# EAGLE design CurrentAmplifier_V2 (EAGLE 7.5.0)
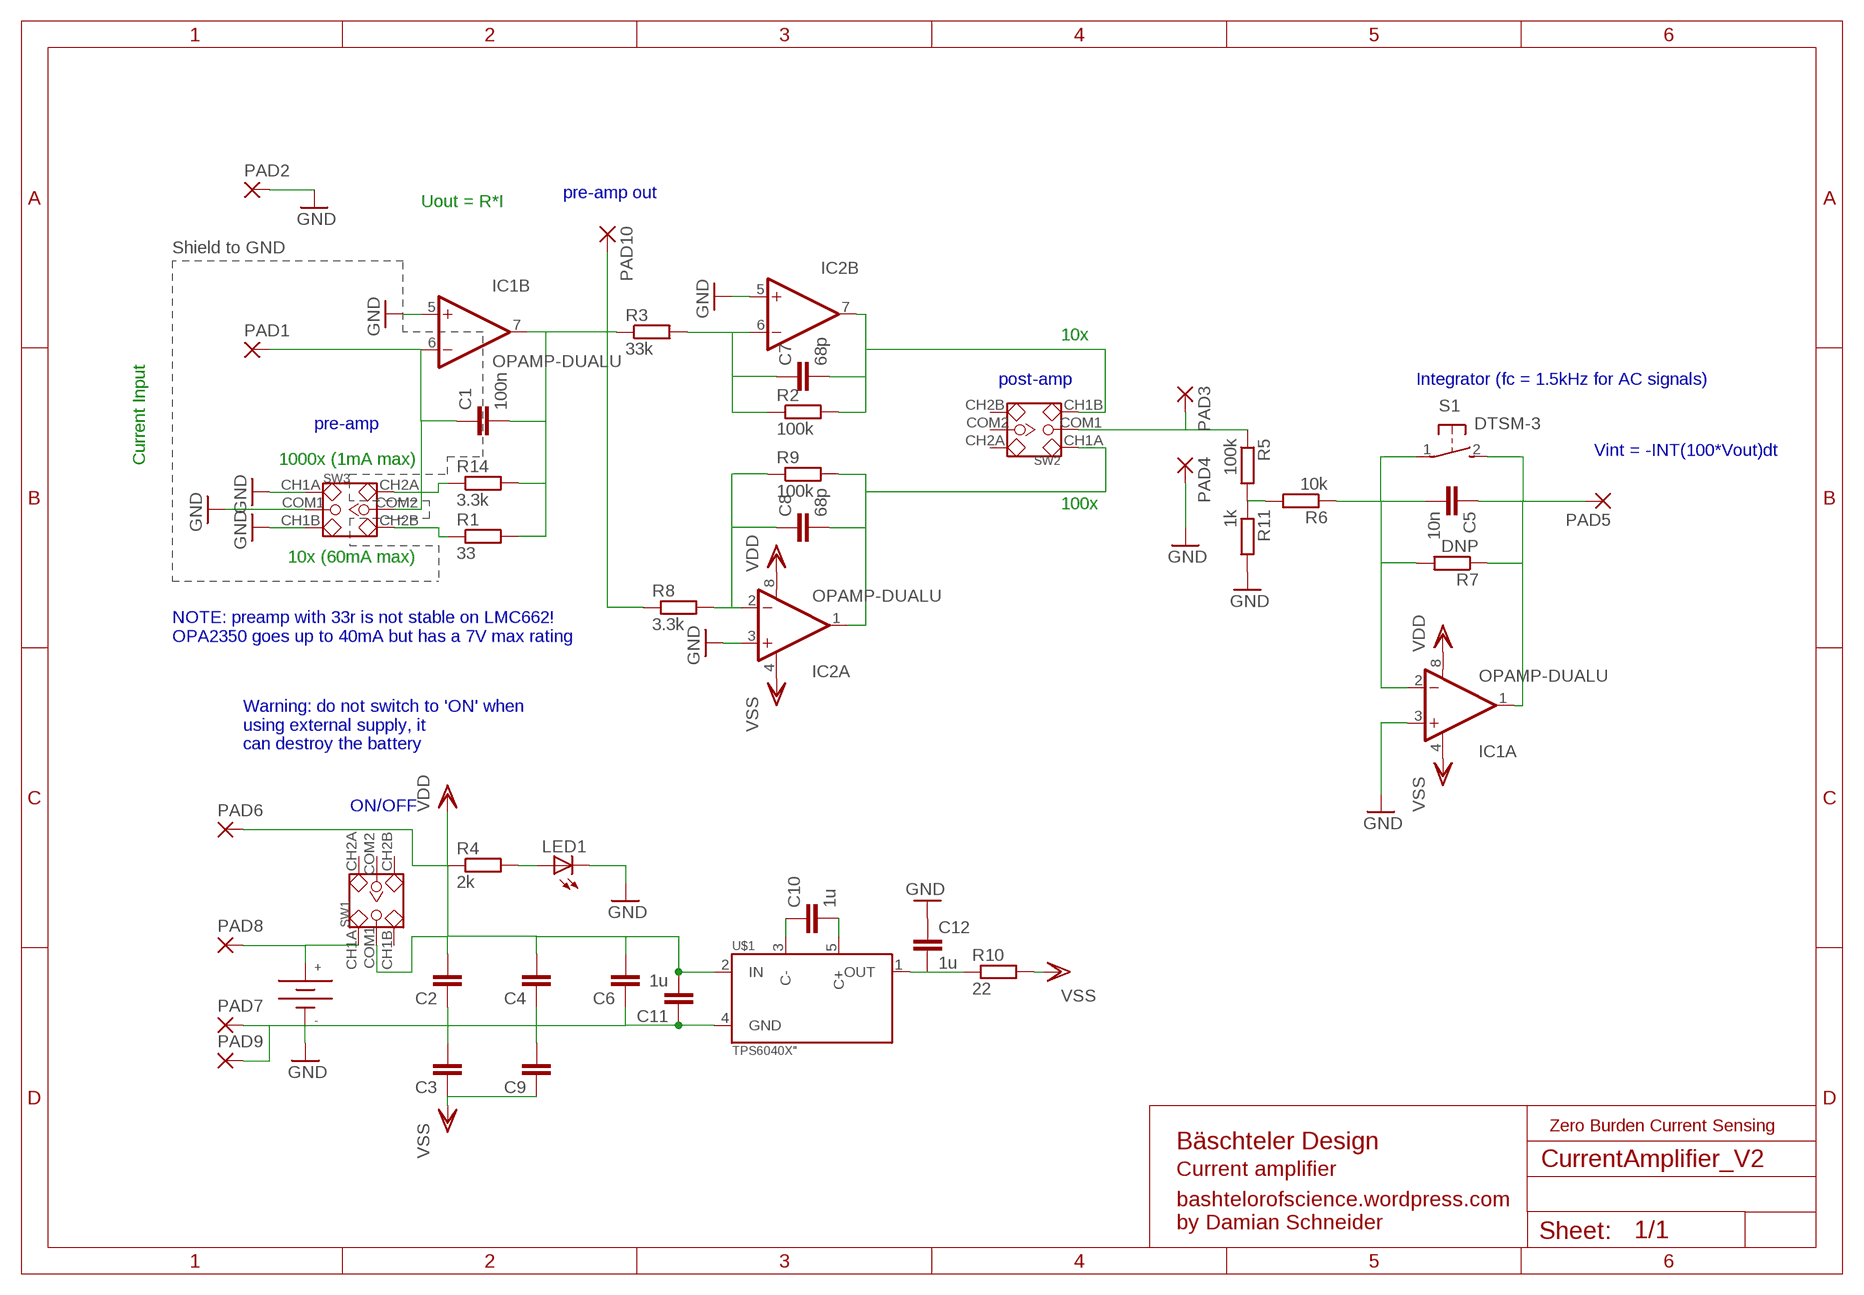
[diagram p0: schematic, sheet 1]

## Parts
C1  100n  C-EUC0805K  [C0805K]
C2  C-EUC0805  [C0805]
C3  C-EUC0805  [C0805]
C4  C-EUC0805  [C0805]
C5  10n  C-EUC0805K  [C0805K]
C6  C-EUC1206  [C1206]
C7  68p  C-EUC0603  [C0603]
C8  68p  C-EUC0603  [C0603]
C9  C-EUC1206  [C1206]
C10  1u  C-EUC0603  [C0603]
C11  1u  C-EUC0603  [C0603]
C12  1u  C-EUC0603  [C0603]
CR1  DX_CR2032HANDSOLDER  [DX_CR2032_SMD_HANDSOLDER]
IC1  OPAMP-DUALU  [SO08]
IC2  OPAMP-DUALU  [SO08]
LED1  LEDCHIP-LED0805  [CHIP-LED0805]
PAD1  1,6/0,9  [1,6/0,9]
PAD2  1,6/0,9  [1,6/0,9]
PAD3  1,6/0,9  [1,6/0,9]
PAD4  1,6/0,9  [1,6/0,9]
PAD5  1,6/0,9  [1,6/0,9]
PAD6  1,6/0,9  [1,6/0,9]
PAD7  1,6/0,9  [1,6/0,9]
PAD8  1,6/0,9  [1,6/0,9]
PAD9  1,6/0,9  [1,6/0,9]
PAD10  1,6/0,9  [1,6/0,9]
R1  33  R-EU_R0805  [R0805]
R2  100k  R-EU_R0603  [R0603]
R3  33k  R-EU_R0603  [R0603]
R4  2k  R-EU_R0603  [R0603]
R5  100k  R-EU_R0603  [R0603]
R6  10k  R-EU_R0603  [R0603]
R7  DNP  R-EU_R0805  [R0805]
R8  3.3k  R-EU_R0603  [R0603]
R9  100k  R-EU_R0603  [R0603]
R10  22  R-EU_R0805  [R0805]
R11  1k  R-EU_R0603  [R0603]
R14  3.3k  R-EU_R0805  [R0805]
S1  DTSM-3  [DTSM-3]
SW1  DIP-TOGGLE-SWITCH-2CH-(2X3P-2.54)  [SW6-2.54-9.0X3.5X3.2+2.0MM]
SW2  DIP-TOGGLE-SWITCH-2CH-(2X3P-2.54)  [SW6-2.54-9.0X3.5X3.2+2.0MM]
SW3  DIP-TOGGLE-SWITCH-2CH-(2X3P-2.54)  [SW6-2.54-9.0X3.5X3.2+2.0MM]
U$1  TPS6040X"  [SOT23-5]

## Nets
+: CR1.P$1(+) PAD8.1(P) SW1.CH1A
GND: C2.1 C3.2 C4.1 C6.1 C9.2 C11.1 C12.1 CR1.P$2(-) IC1.3(A:+IN) IC1.5(B:+IN) IC2.3(A:+IN) IC2.5(B:+IN) LED1.C PAD2.1(P) PAD4.1(P) PAD7.1(P) PAD9.1(P) R11.2 SW3.CH1A SW3.CH1B SW3.COM1 U$1.4(GND)
N$1: C1.2 IC1.7(B:OUT) PAD10.1(P) R1.2 R3.1 R8.1 R14.2
N$2: C7.1 IC2.6(B:-IN) R2.1 R3.2
N$3: R5.2 R6.2 R11.1
N$4: C7.2 IC2.7(B:OUT) R2.2 SW2.CH1B
N$5: R14.1 SW3.CH2A
N$6: C10.1 U$1.3(C-)
N$7: C10.2 U$1.5(C+)
N$8: LED1.A R4.2
N$11: C5.2 IC1.2(A:-IN) R6.1 R7.2 S1.1
N$12: C5.1 IC1.1(A:OUT) PAD5.1(P) R7.1 S1.2
N$13: C8.1 IC2.2(A:-IN) R8.2 R9.1
N$14: C8.2 IC2.1(A:OUT) R9.2 SW2.CH1A
N$15: PAD3.1(P) R5.1 SW2.COM1
N$16: C12.2 R10.1 U$1.1(OUT)
N$21: C1.1 IC1.6(B:-IN) PAD1.1(P) SW3.COM2
N$22: R1.1 SW3.CH2B
VDD: C2.2 C4.2 C6.2 C11.2 IC1.8(A:V+) IC2.8(A:V+) PAD6.1(P) R4.1 SW1.COM1 U$1.2(IN)
VSS: C3.1 C9.1 IC1.4(A:V-) IC2.4(A:V-) R10.2
Unconnected: SW1.CH1B SW1.CH2A SW1.CH2B SW1.COM2 SW2.CH2A SW2.CH2B SW2.COM2

## Notes on the sheet
- pre-amp out
- Uout = R*I
- Shield to GND
- 10x
- post-amp | Integrator (fc = 1.5kHz for AC signals)
- pre-amp
- Vint = -INT(100*Vout)dt
- Current Input | 1000x (1mA max)
- 100x
- 10x (60mA max)
- NOTE: preamp with 33r is not stable on LMC662!
  OPA2350 goes up to 40mA but has a 7V max rating
- Warning: do not switch to 'ON' when
  using external supply, it
  can destroy the battery
- ON/OFF
- Zero Burden Current Sensing
- Bäschteler Design
- Current amplifier
- bashtelorofscience.wordpress.com
  by Damian Schneider

## Library data of the parts
C1-C12 = resistor:C-EU: CAPACITOR, European symbol
CR1 = DX_buttoncell_SMT:DX_CR2032
IC1 IC2 = SparkFun-AnalogIC:OPAMP-DUAL: Generic op-amp footprint
LED1 = adafruit:LED: LED OSRAM: - CHIPLED LG R971, LG N971, LY N971, LG Q971, LY Q971, LO R971, LY R971 LH N974, LH R974 LS Q976, LO Q976, LY Q976 LO Q996 - Hyper CHIPLED LW Q18S LB Q993, LB Q99A, LB R99A - SideLED LS A670, LO A670, LY A670, LG A670, LP A670 LB A673, LV A673, LT A673, LW A673 LH A674 LY A675 LS A676, LA A676, LO A676, LY A676, LW A676 LS A679, LY A679, LG A679 - Hyper Micro SIDELED® LS Y876, LA Y876, LO Y876, LY Y876 LT Y87S - SmartLED LW L88C, LW L88S LB L89C, LB L89S, LG L890 LS L89K, LO L89K, LY L89K LS L896, LA L896, LO L896, LY L896 - TOPLED LS T670, LO T670, LY T670, LG T670, LP T670 LSG T670, LSP T670, LSY T670, LOP T670, LYG T670 LG T671, LOG T671, LSG T671 LB T673, LV T673, LT T673, LW T673 LH T674 LS T676, LA T676, LO T676, LY T676, LB T676, LH T676, LSB T676, LW T676 LB T67C, LV T67C, LT T67C, LS T67K, LO T67K, LY T67K, LW E67C LS E67B, LA E67B, LO E67B, LY E67B, LB E67C, LV E67C, LT E67C LW T67C LS T679, LY T679, LG T679 LS T770, LO T770, LY T770, LG T770, LP T770 LB T773, LV T773, LT T773, LW T773 LH T774 LS E675, LA E675, LY E675, LS T675 LS T776, LA T776, LO T776, LY T776, LB T776 LHGB T686 LT T68C, LB T68C - Hyper Mini TOPLED® LB M676 - Mini TOPLED Santana® LG M470 LS M47K, LO M47K, LY M47K Source: http://www.osram.convergy.de/
PAD1-PAD10 = wirepad:1,6/0,9: THROUGH-HOLE PAD
R1-R11 R14 = resistor:R-EU_: RESISTOR, European symbol
S1 = switch-mini-chinese-tact:DTSM-3
SW1-SW3 = Seeed-OPL-Switch:DIP-TOGGLE-SWITCH-2CH-(2X3P-2.54): 311010004; MPN: MS-22D18
U$1 = TPS6040x:TPS6040X: SOT5 switching cap inverter 5.25V, 60mA

## Board
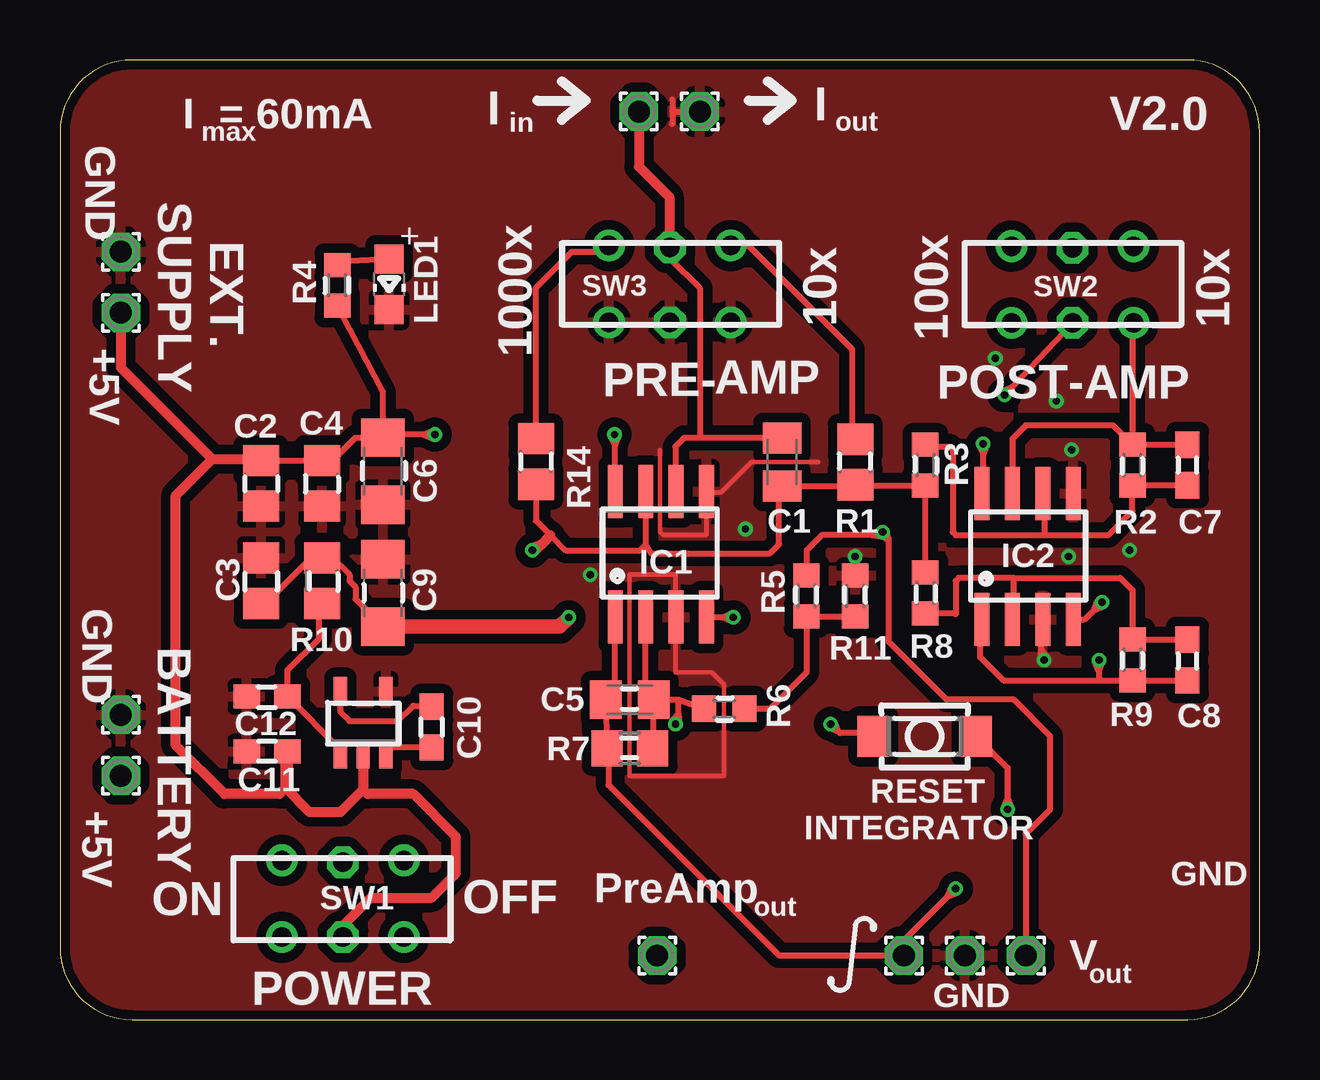
[diagram p1: board, top side]
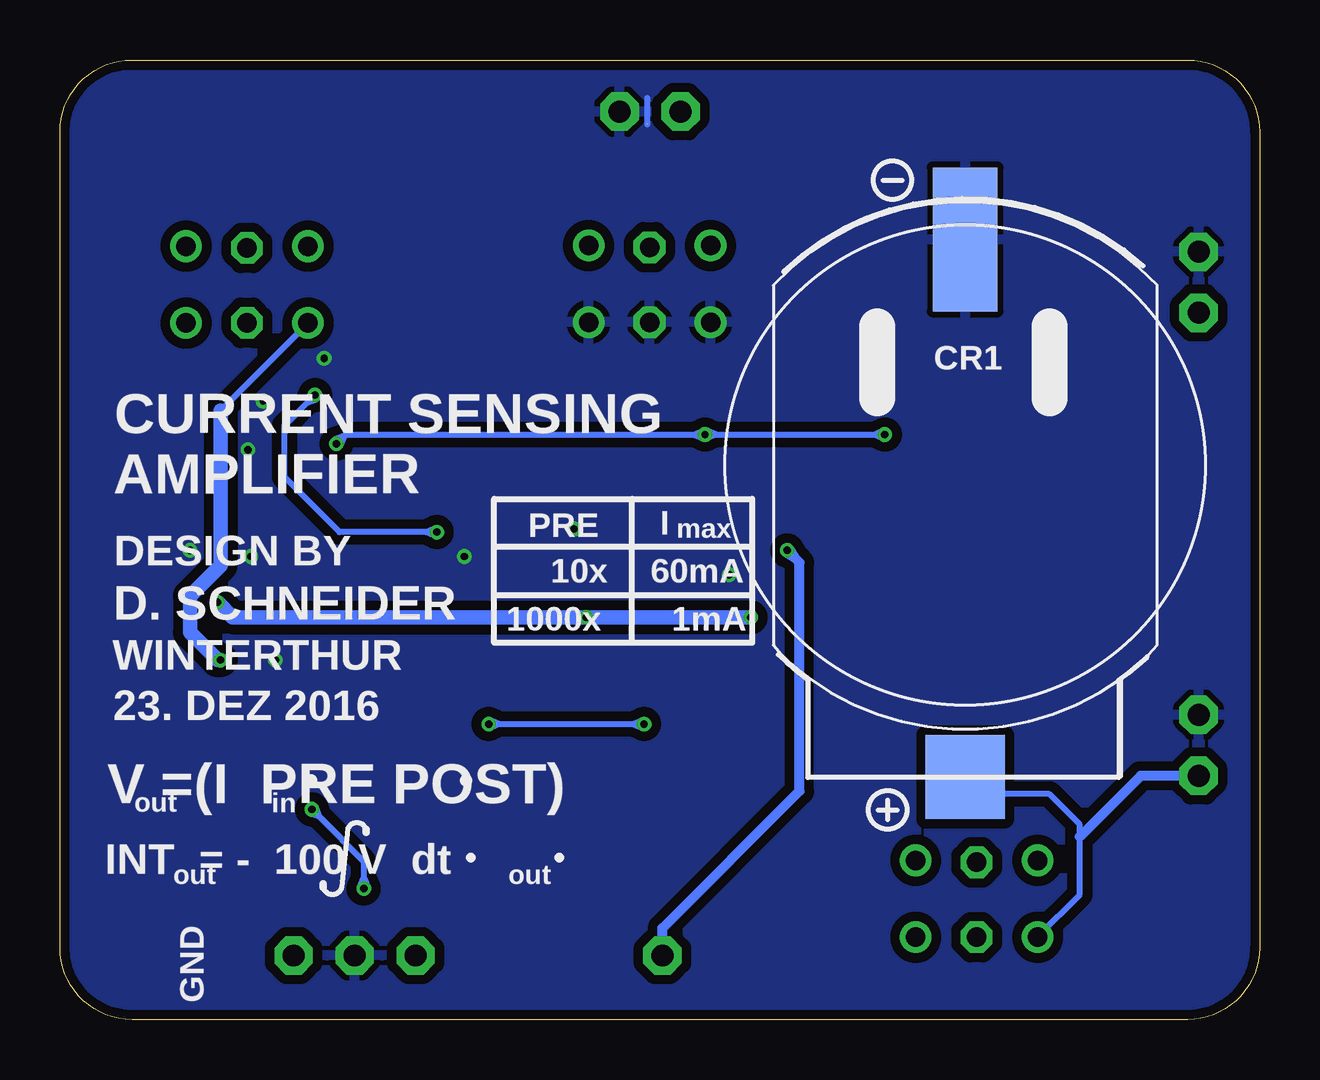
[diagram p2: board, bottom side, seen from below]

Size 50 x 40 mm. Coordinates in mm from the lower left corner, seen from the top.
Outline: 0,37 0,3 arc90 3,0 47,0 arc90 50,3 50,37 arc90 47,40 3,40 arc90 0,37
Copper layers (1*16): Top 0.035mm / dielectric 1.5mm / Bottom 0.035mm
Design rules "dirt_cheap_dirty_boards.v1": minimum track width 5mil, minimum drill 12mil, track to track 5mil, track to pad 5mil, pad to pad 5mil, via to via 5mil, smd to smd 0mil, copper to edge 10mil, drill to drill 10mil, minimum pad ring 10mil, minimum via ring 6mil, stop-mask expansion 2mil, vias tented up to drill 25mil, thermal gap 10mil

### Footprints (pad centres in the part's own frame; a part is rotated, then mirrored left to right if it is on the bottom)
C0805K = smd 1.3 x 1.6: 1 -1,0; 2 1,0
C0805 = smd 1.3 x 1.5: 1 -0.95,0; 2 0.95,0
C1206 = smd 1.6 x 1.8: 1 -1.4,0; 2 1.4,0
C0603 = smd 1.1 x 1: 1 -0.85,0; 2 0.85,0
DX_CR2032_SMD_HANDSOLDER = smd 3.3 x 3.5: P$1 0,-13 | smd 2.7 x 6: P$2 0,9.4
SO08 = smd 0.61 x 2.21: 1 -1.905,-2.616; 2 -0.635,-2.616; 3 0.635,-2.616; 4 1.905,-2.616; 5 1.905,2.616; 6 0.635,2.616; 7 -0.635,2.616; 8 -1.905,2.616
CHIP-LED0805 = smd 1.2 x 1.2: A 0,-1.05; C 0,1.05
1,6/0,9 = drill 0.914 pad 1.6 octagon: 1 0,0
R0805 = smd 1.3 x 1.5: 1 -0.95,0; 2 0.95,0
R0603 = smd 1 x 1.1: 1 -0.85,0; 2 0.85,0
DTSM-3 = smd 1.3 x 1.7: 1 -2.15,0; 2 2.15,0
SW6-2.54-9.0X3.5X3.2+2.0MM = drill 0.813 pad 1.27: CH1A -2.54,-1.6; CH1B 2.54,-1.6; CH2A -2.54,1.6; CH2B 2.54,1.6 | drill 0.813 pad 1.27 octagon: COM1 0,-1.6; COM2 0,1.524
SOT23-5 = smd 0.55 x 1.2: 1 -0.95,-1.3; 2 0,-1.3; 3 0.95,-1.3; 4 0.95,1.3; 5 -0.95,1.3

### Placement (x,y rotation side)
C1  30.1,23.24 270 top
C2  8.38,22.35 90 top
C3  8.38,18.29 90 top
C4  10.92,22.35 90 top
C5  23.75,13.34 0 top
C6  13.46,22.86 90 top
C7  46.99,23.11 90 top
C8  46.99,14.99 270 top
C9  13.46,17.78 90 top
C10  15.49,12.19 90 top
C11  8.64,11.18 0 top
C12  8.64,13.46 0 top
CR1  12.27,23.11 0 bottom
IC1  25.04,19.39 0 top
IC2  40.33,19.3 0 top
LED1  13.72,30.65 180 top
PAD1  24.13,37.85 0 top
PAD2  26.67,37.85 0 top
PAD3  40.26,2.67 90 top
PAD4  37.72,2.67 90 top
PAD5  35.18,2.67 90 top
PAD6  2.54,29.46 0 top
PAD7  2.54,32 0 top
PAD8  2.54,10.16 0 top
PAD9  2.54,12.7 0 top
PAD10  24.89,2.67 0 top
R1  33.15,23.24 270 top
R2  44.7,23.11 90 top
R3  36.07,23.11 90 top
R4  11.56,30.61 90 top
R5  31.11,17.65 270 top
R6  27.69,12.95 0 top
R7  23.75,11.3 0 top
R8  36.07,17.78 270 top
R9  44.7,14.99 270 top
R10  10.92,18.29 90 top
R11  33.15,17.65 90 top
R14  19.84,23.26 270 top
S1  36.04,11.8 0 top
SW1  11.79,5.03 0 top
SW2  42.2,30.64 0 top
SW3  25.42,30.67 0 top
U$1  12.64,12.38 0 top
U$2  [CC-BY-NC-SA_SR]  48.4,34.4 0 bottom
U$5  [OSH_LOGO_L_SR]  31.7,35.7 0 bottom

### Tracks (layer width: path | path; a pad name or v marks a point on that pad's centre or on a via)
+
  Bottom 0.254: SW1.CH1A 9.25,3.45 7.49,5.21 7.49,7.62 7.49,8.13 8.76,9.4 11.56,9.4 CR1.P$1
  Bottom 0.406: PAD8.1 4.95,10.16 7.49,7.62
GND  (via drill 0.3)  (1 unrouted)
  Top 0.178: 25.02,23.75 25.02,20.32 25.15,20.19 26.92,20.19 26.95,20.22 IC1.5 26.98,21.97 27.56,21.97 28.83,23.24 31.62,23.24 | 25.65,16.75 25.65,18.54 23.75,18.54 23.75,10.16 27.69,10.16 27.69,13.97 27.18,14.48 25.65,14.48 25.65,16.75
  Top 0.254: 25.53,37.85 25.53,37.34 | IC2.3 40.89,16.61 40.89,15.43 | 40.89,15.43 40.89,15.11 | 25.53,38.35 25.53,37.85 | 25.53,37.85 PAD2.1 | 25.65,16.75 IC1.3 | 40.89,15.43 40.84,15.01 v41.02,14.99 41.16,15.1 40.89,15.43
  Bottom 0.254: 25.52,38.43 25.52,37.32
  other vias: 44.58,19.56 42.16,23.75 42.04,19.3 41.53,25.78 38.99,27.56 22.1,18.54 28.57,20.45 33.15,19.3
  pour Top (isolate 0.4): 0,4 0,37 arc-90 3,40 46.84,40 arc-90 50,36.84 50,3 arc-90 47,0 4,0 arc-90
  pour Bottom (isolate 0.4): 3,40 47.14,40 arc-90 50,36.84 50,3 arc-90 47,0 4,0 arc-90 0,4 0,37 arc-90
N$1  (via drill 0.3)
  Top 0.254: IC1.7 24.41,19.79 | 24.41,19.79 24.64,19.43 29.59,19.43 29.97,19.81 29.97,22.11 C1.2 33.1,22.24 R1.2 33.17,22.26 R3.1 R8.1 | R14.2 19.84,20.8 20.45,20.19 21.08,19.56 24.18,19.56 24.41,19.79
  Top 0.406: v19.68,19.56 19.81,19.56 20.07,19.81 | 20.07,19.81 20.45,20.19 | 20.07,19.81 19.65,19.65 v19.68,19.56 | 20.07,19.81 19.76,19.49 v19.68,19.56
  Bottom 0.406: PAD10.1 24.89,3.81 19.18,9.53 19.18,19.05 19.36,19.23 | 19.36,19.23 v19.68,19.56 | 19.36,19.23 19.74,19.47 v19.68,19.56 | 19.36,19.23 19.6,19.61 v19.68,19.56
N$2
  Top 0.254: C7.1 R2.1 44.7,21.21 43.69,20.19 41.02,20.19 | IC2.6 41.02,21.87 41.02,20.19 | R3.2 36.16,23.88 37.08,23.88 37.21,23.75 37.21,20.32 37.34,20.19 41.02,20.19
N$3
  Top 0.254: R11.1 R5.2 31.11,14.48 29.59,12.95 R6.2
N$4
  Top 0.254: R2.2 C7.2 | SW2.CH1B 44.7,29 R2.2 | R2.2 43.9,24.77 40.26,24.77 39.7,24.2 IC2.7
N$5
  Top 0.254: R14.1 19.84,30.51 21.34,32 22.62,32 SW3.CH2A
N$6
  Top 0.254: C10.1 13.85,11.34 U$1.3
N$7
  Top 0.254: U$1.5 11.69,12.82 12.06,12.45 14.1,12.45 14.73,13.08 15.46,13.08 C10.2
N$8
  Top 0.254: LED1.A 12.06,31.62 11.71,31.46 R4.2
N$11  (via drill 0.3)
  Top 0.254: 24.64,12.99 C5.2 R7.2 | 24.64,12.99 24.64,13.59 24.41,13.82 IC1.2 | 24.64,12.99 24.68,13.34 25.78,13.34 | 25.78,13.34 R6.1 | S1.1 33.76,11.94 32.51,11.94 32.45,12 | 32.45,12 v32.13,12.32 | v25.65,12.32 25.78,12.45 25.78,12.76 | 25.78,12.76 25.78,13.34 | 32.45,12 32.3,12.39 v32.13,12.32 | 32.45,12 32.06,12.15 v32.13,12.32 | 25.78,12.76 25.52,12.43 v25.65,12.32 | 25.78,12.76 25.83,12.34 v25.65,12.32
  Bottom 0.254: v32.13,12.32 31.67,12.32 | 31.67,12.32 26.11,12.32 | 26.11,12.32 v25.65,12.32 | 31.67,12.32 32.06,12.15 v32.13,12.32 | 31.67,12.32 32.06,12.48 v32.13,12.32 | 26.11,12.32 25.72,12.48 v25.65,12.32 | 26.11,12.32 25.72,12.15 v25.65,12.32
N$12  (via drill 0.3)
  Top 0.254: S1.2 39.5,10.5 39.5,9.22 | 39.5,9.22 v39.5,8.76 | v37.34,5.46 37.02,5.14 | 37.02,5.14 35.18,3.3 PAD5.1 29.97,2.67 22.86,9.78 22.86,11.26 R7.1 C5.1 23.11,13.72 23.11,16.77 IC1.1 | 39.5,9.22 39.33,8.83 v39.5,8.76 | 39.5,9.22 39.66,8.83 v39.5,8.76 | 37.02,5.14 37.41,5.3 v37.34,5.46 | 37.02,5.14 37.17,5.53 v37.34,5.46
  Bottom 0.254: v39.5,8.76 39.17,8.44 | 39.17,8.44 37.34,6.6 37.34,5.92 | 37.34,5.92 v37.34,5.46 | 39.17,8.44 39.56,8.6 v39.5,8.76 | 39.17,8.44 39.33,8.83 v39.5,8.76 | 37.34,5.92 37.17,5.53 v37.34,5.46 | 37.34,5.92 37.5,5.53 v37.34,5.46
N$13
  Top 0.254: IC2.2 39.75,16.74 39.75,18.41 | 39.75,18.41 37.47,18.41 37.34,18.29 37.34,16.89 37.3,16.93 R8.2 | 39.75,18.41 44.2,18.41 44.7,17.91 R9.1 C8.1
N$14  (via drill 0.3)
  Top 0.254: C8.2 R9.2 43.31,14.14 | IC2.1 38.35,16.61 38.35,15.11 39.33,14.14 43.31,14.14 | v43.31,14.99 43.31,14.53 | 43.31,14.53 43.31,14.14 | 43.31,14.53 43.47,14.92 v43.31,14.99 | 43.31,14.53 43.14,14.92 v43.31,14.99
  Bottom 0.254: SW2.CH1A 43.31,25.39
  Bottom 0.61: 43.31,25.39 43.31,18.92 44.58,17.65 44.58,16.13 43.43,14.99 v43.31,14.99
N$15  (via drill 0.3)
  Top 0.254: v39.37,26.04 SW2.COM1 | PAD3.1 40.26,7.75 41.27,8.76 41.27,11.81 39.75,13.34 36.96,13.34 34.54,15.75 34.54,19.94 | v34.29,20.32 34.16,20.19 33.85,20.19 | 33.85,20.19 31.75,20.19 31.11,19.56 R5.1 | 34.54,19.94 34.54,20.07 v34.29,20.32 | 33.85,20.19 34.27,20.14 v34.29,20.32 | 33.85,20.19 34.18,20.46 v34.29,20.32 | 34.54,19.94 34.47,20.35 v34.29,20.32 | 34.54,19.94 34.19,20.17 v34.29,20.32 | v39.37,26.04 39.3,26.2 39.68,26.37 39.54,25.97 v39.37,26.04
  Bottom 0.254: v34.29,20.32 34.75,20.32 | 34.75,20.32 38.35,20.32 40.64,22.61 40.64,24.77 39.69,25.71 | 39.69,25.71 v39.37,26.04 | 34.75,20.32 34.36,20.48 v34.29,20.32 | 34.75,20.32 34.36,20.16 v34.29,20.32 | 39.69,25.71 39.53,26.1 v39.37,26.04 | 39.69,25.71 39.3,25.87 v39.37,26.04
N$16
  Top 0.254: U$1.1 11.69,11.26 C12.2 9.49,14.57 10.79,15.88 10.79,17.21 R10.1
N$21
  Top 0.254: SW3.COM2 25.42,31.73 26.67,30.48 26.67,24.27 26.7,24.24 | 30.23,24.37 C1.1 26.7,24.24 | 26.7,24.24 26.02,24.24 25.65,23.88 25.65,22.03 IC1.6
  Top 0.406: PAD1.1 24.13,35.56 25.4,34.29 25.4,32.22 SW3.COM2
N$22
  Top 0.254: SW3.CH2B 28.69,32.27 33.02,27.94 33.02,24.32 R1.1
VDD  (via drill 0.3)
  Top 0.254: C2.2 C4.2 11.36,23.3 12.32,24.26 C6.2 | C6.2 13.46,26.16 R4.1 | IC1.8 23.14,23.93 | 23.14,23.93 23.14,24.36 v23.11,24.38 | v15.62,24.38 15.16,24.38 | 15.16,24.38 13.59,24.38 C6.2 | IC2.8 38.48,21.97 38.48,23.55 | 38.48,23.55 v38.48,24 | 23.14,23.93 23.28,24.32 v23.11,24.38 | 23.14,23.93 22.95,24.31 v23.11,24.38 | 15.16,24.38 15.55,24.22 v15.62,24.38 | 15.16,24.38 15.55,24.55 v15.62,24.38 | 38.48,23.55 38.65,23.93 v38.48,24 | 38.48,23.55 38.32,23.93 v38.48,24
  Top 0.406: PAD6.1 2.54,27.18 6.35,23.37 | 6.35,23.37 8.32,23.37 C2.2 | U$1.2 12.64,9.59 | 12.64,9.59 11.68,8.64 10.41,8.64 9.4,9.65 9.4,11.09 C11.2 9.49,9.74 9.14,9.4 6.86,9.4 4.83,11.43 4.83,21.84 6.35,23.37 | SW1.COM1 11.79,3.92 12.95,5.08 15.49,5.08 16.51,6.1 16.51,7.62 14.73,9.4 12.83,9.4 12.64,9.59
  Bottom 0.254: v23.11,24.38 22.66,24.38 | 22.66,24.38 16.08,24.38 | 16.08,24.38 v15.62,24.38 | v38.48,24 38.16,24.33 | 38.16,24.33 38.1,24.38 23.57,24.38 | 23.57,24.38 v23.11,24.38 | 22.66,24.38 23.05,24.22 v23.11,24.38 | 22.66,24.38 23.05,24.55 v23.11,24.38 | 23.57,24.38 23.18,24.55 v23.11,24.38 | 23.57,24.38 23.18,24.22 v23.11,24.38 | 16.08,24.38 15.69,24.55 v15.62,24.38 | 16.08,24.38 15.69,24.22 v15.62,24.38 | 38.16,24.33 38.32,23.94 v38.48,24 | 38.16,24.33 38.55,24.17 v38.48,24
VSS  (via drill 0.3)
  Top 0.254: C3.1 8.57,17.34 10.29,19.05 10.73,19.05 R10.2 11.37,19.24 12.06,18.54 12.06,18.29 12.32,18.03 12.32,17.52 C9.1 | v28.07,16.76 27.61,16.76 | 27.61,16.76 IC1.4 | IC2.4 42.72,16.69 43.11,17.08 | 43.11,17.08 v43.43,17.4 | 27.61,16.76 28,16.6 v28.07,16.76 | 27.61,16.76 28,16.93 v28.07,16.76 | 43.11,17.08 43.5,17.23 v43.43,17.4 | 43.11,17.08 43.27,17.47 v43.43,17.4
  Top 0.61: C9.1 20.82,16.38 v21.21,16.76
  Bottom 0.61: v21.21,16.76 v28.07,16.76 42.8,16.76 v43.43,17.4

### Text on the board
tNames: I = 60mA | max | I | in | I | out | V2.0 | GND | SUPPLY | EXT. | 10x | 10x | +5V | 1000x | AMP | 100x | PRE- | POST-AMP | GND | BATTERY | RESET | +5V | INTEGRATOR | ON | OFF | GND | PreAmp | out | POWER | V | out | GND
bNames: CURRENT SENSING | AMPLIFIER | max | I | PRE | DESIGN BY | 60mA | 10x | D. SCHNEIDER | 1mA | 1000x | WINTERTHUR | 23. DEZ 2016 | in | out | V =(I PRE POST) | out | out | INT = - 100 V dt | GND